# Altium schematic sheet Top sheet.SchDoc
size B
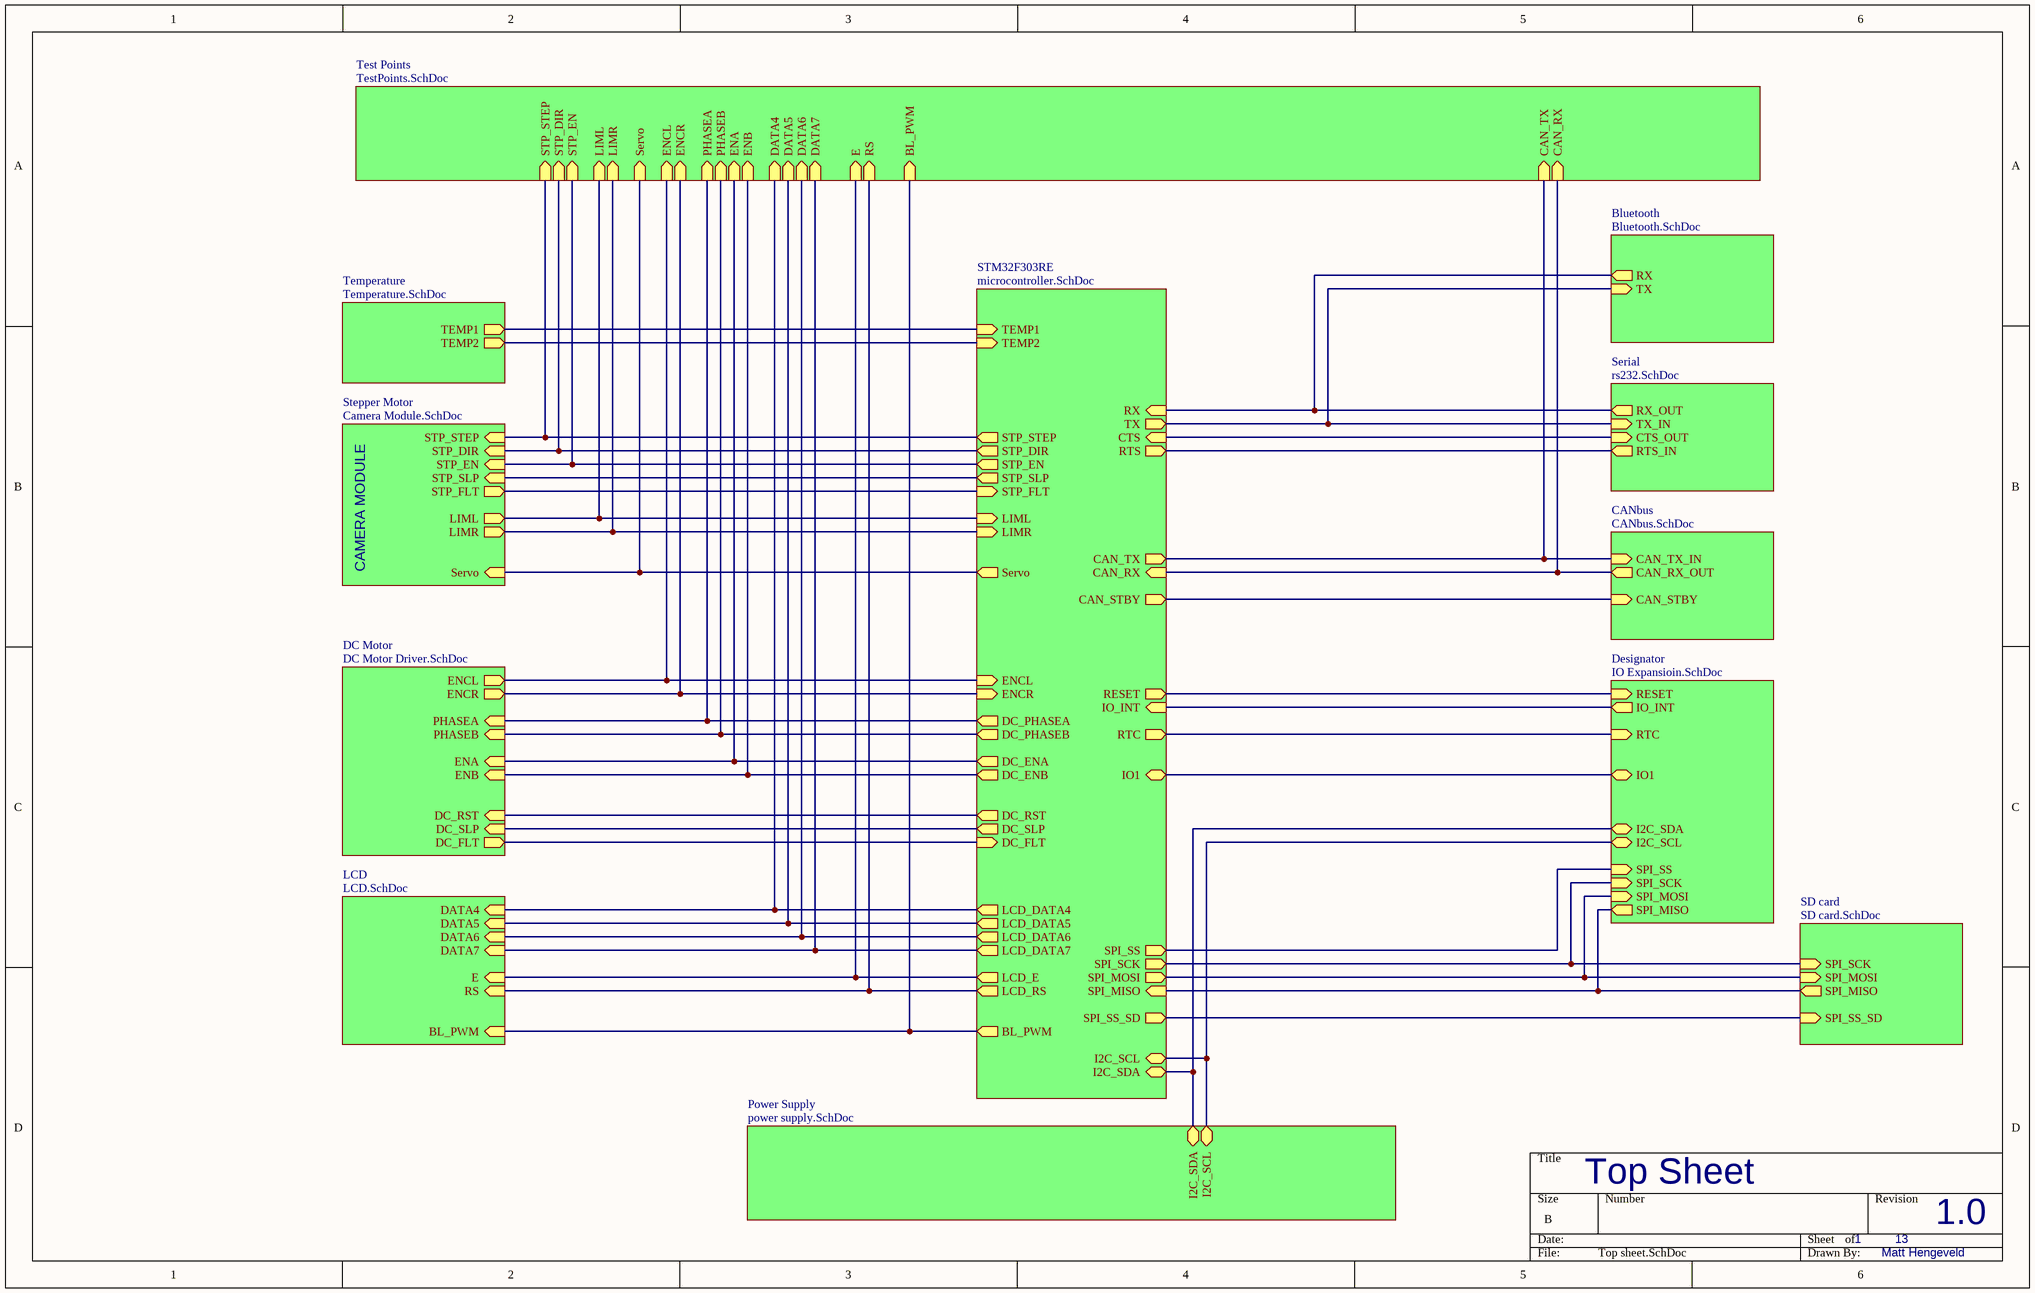
[diagram p0: Top sheet.SchDoc]

## Sub-sheets
Bluetooth = Bluetooth.SchDoc: RX (out), TX (in)
CANbus = CANbus.SchDoc: CAN_TX_IN (in), CAN_RX_OUT (out), CAN_STBY (in)
DC Motor = DC Motor Driver.SchDoc: PHASEA (in), ENCL (out), ENA (in), DC_FLT (out), DC_SLP (in), DC_RST (in), ENCR (out), PHASEB (in), ENB (in)
Designator = IO Expansioin.SchDoc: SPI_MISO (out), SPI_MOSI (in), SPI_SCK (in), SPI_SS (in), IO_INT (out), RESET (in), I2C_SDA (bidir), I2C_SCL (bidir), RTC (in), IO1 (bidir)
LCD = LCD.SchDoc: DATA4 (in), E (in), RS (in), BL_PWM (in), DATA5 (in), DATA6 (in), DATA7 (in)
Power Supply = power supply.SchDoc: I2C_SDA (bidir), I2C_SCL (bidir)
SD card = SD card.SchDoc: SPI_SCK (in), SPI_MOSI (in), SPI_MISO (out), SPI_SS_SD (in)
Serial = rs232.SchDoc: TX_IN (in), RTS_IN (out), RX_OUT (out), CTS_OUT (in)
Stepper Motor = Camera Module.SchDoc: STP_STEP (in), LIML (out), STP_EN (in), STP_SLP (in), STP_FLT (out), Servo (in), STP_DIR (in), LIMR (out)
STM32F303RE = microcontroller.SchDoc: Servo (out), STP_STEP (out), DC_PHASEA (out), DC_ENA (out), LCD_RS (out), LCD_E (out), LCD_DATA4 (out), RX (in), CAN_TX (out), TX (out), CTS (in), RTS (out), CAN_RX (in), CAN_STBY (out), DC_FLT (in), DC_SLP (out), DC_RST (out), STP_FLT (in), STP_SLP (out), STP_EN (out), BL_PWM (out), ENCL (in), LIML (in), STP_DIR (out), SPI_SS (out), SPI_SCK (out), SPI_MOSI (out), I2C_SCL (bidir), I2C_SDA (bidir), SPI_MISO (in), IO_INT (in), RESET (out), LCD_DATA5 (out), LCD_DATA6 (out), LCD_DATA7 (out), ENCR (in), DC_PHASEB (out), DC_ENB (out), LIMR (in), RTC (out), IO1 (bidir), TEMP1 (in), TEMP2 (in), SPI_SS_SD (out)
Temperature = Temperature.SchDoc: TEMP1 (out), TEMP2 (out)
Test Points = TestPoints.SchDoc: STP_STEP (in), STP_DIR (in), STP_EN (in), LIML (in), LIMR (in), Servo (in), ENCL (in), ENCR (in), PHASEA (in), PHASEB (in), ENA (in), ENB (in), DATA4 (in), DATA5 (in), DATA6 (in), DATA7 (in), CAN_RX (in), CAN_TX (in), E (in), RS (in), BL_PWM (in)

## Nets
(unnamed): sheet Power Supply/I2C_SDA, sheet STM32F303RE/I2C_SDA, sheet Designator/I2C_SDA
(unnamed): sheet Power Supply/I2C_SCL, sheet STM32F303RE/I2C_SCL, sheet Designator/I2C_SCL
(unnamed): sheet STM32F303RE/Servo, sheet Stepper Motor/Servo, sheet Test Points/Servo
(unnamed): sheet STM32F303RE/STP_STEP, sheet Stepper Motor/STP_STEP, sheet Test Points/STP_STEP
(unnamed): sheet STM32F303RE/DC_PHASEA, sheet DC Motor/PHASEA, sheet Test Points/PHASEA
(unnamed): sheet STM32F303RE/DC_ENA, sheet DC Motor/ENA, sheet Test Points/ENA
(unnamed): sheet STM32F303RE/LCD_RS, sheet LCD/RS, sheet Test Points/RS
(unnamed): sheet STM32F303RE/LCD_E, sheet LCD/E, sheet Test Points/E
(unnamed): sheet STM32F303RE/LCD_DATA4, sheet LCD/DATA4, sheet Test Points/DATA4
(unnamed): sheet STM32F303RE/RX, sheet Serial/RX_OUT, sheet Bluetooth/RX
(unnamed): sheet STM32F303RE/CAN_TX, sheet CANbus/CAN_TX_IN, sheet Test Points/CAN_TX
(unnamed): sheet STM32F303RE/TX, sheet Serial/TX_IN, sheet Bluetooth/TX
(unnamed): sheet STM32F303RE/CTS, sheet Serial/CTS_OUT
(unnamed): sheet STM32F303RE/RTS, sheet Serial/RTS_IN
(unnamed): sheet STM32F303RE/CAN_RX, sheet CANbus/CAN_RX_OUT, sheet Test Points/CAN_RX
(unnamed): sheet STM32F303RE/CAN_STBY, sheet CANbus/CAN_STBY
(unnamed): sheet STM32F303RE/DC_FLT, sheet DC Motor/DC_FLT
(unnamed): sheet STM32F303RE/DC_SLP, sheet DC Motor/DC_SLP
(unnamed): sheet STM32F303RE/DC_RST, sheet DC Motor/DC_RST
(unnamed): sheet STM32F303RE/STP_FLT, sheet Stepper Motor/STP_FLT
(unnamed): sheet STM32F303RE/STP_SLP, sheet Stepper Motor/STP_SLP
(unnamed): sheet STM32F303RE/STP_EN, sheet Stepper Motor/STP_EN, sheet Test Points/STP_EN
(unnamed): sheet STM32F303RE/BL_PWM, sheet LCD/BL_PWM, sheet Test Points/BL_PWM
(unnamed): sheet STM32F303RE/ENCL, sheet DC Motor/ENCL, sheet Test Points/ENCL
(unnamed): sheet STM32F303RE/LIML, sheet Stepper Motor/LIML, sheet Test Points/LIML
(unnamed): sheet STM32F303RE/STP_DIR, sheet Stepper Motor/STP_DIR, sheet Test Points/STP_DIR
(unnamed): sheet STM32F303RE/SPI_SS, sheet Designator/SPI_SS
(unnamed): sheet STM32F303RE/SPI_SCK, sheet Designator/SPI_SCK, sheet SD card/SPI_SCK
(unnamed): sheet STM32F303RE/SPI_MOSI, sheet Designator/SPI_MOSI, sheet SD card/SPI_MOSI
(unnamed): sheet STM32F303RE/SPI_MISO, sheet Designator/SPI_MISO, sheet SD card/SPI_MISO
(unnamed): sheet STM32F303RE/IO_INT, sheet Designator/IO_INT
(unnamed): sheet STM32F303RE/RESET, sheet Designator/RESET
(unnamed): sheet STM32F303RE/LCD_DATA5, sheet LCD/DATA5, sheet Test Points/DATA5
(unnamed): sheet STM32F303RE/LCD_DATA6, sheet LCD/DATA6, sheet Test Points/DATA6
(unnamed): sheet STM32F303RE/LCD_DATA7, sheet LCD/DATA7, sheet Test Points/DATA7
(unnamed): sheet STM32F303RE/ENCR, sheet DC Motor/ENCR, sheet Test Points/ENCR
(unnamed): sheet STM32F303RE/DC_PHASEB, sheet DC Motor/PHASEB, sheet Test Points/PHASEB
(unnamed): sheet STM32F303RE/DC_ENB, sheet DC Motor/ENB, sheet Test Points/ENB
(unnamed): sheet STM32F303RE/LIMR, sheet Stepper Motor/LIMR, sheet Test Points/LIMR
(unnamed): sheet STM32F303RE/RTC, sheet Designator/RTC
(unnamed): sheet STM32F303RE/IO1, sheet Designator/IO1
(unnamed): sheet STM32F303RE/TEMP1, sheet Temperature/TEMP1
(unnamed): sheet STM32F303RE/TEMP2, sheet Temperature/TEMP2
(unnamed): sheet STM32F303RE/SPI_SS_SD, sheet SD card/SPI_SS_SD

## Notes on the sheet
- CAMERA MODULE
- Top Sheet
- 1
- 13
- 1.0
- Matt Hengeveld